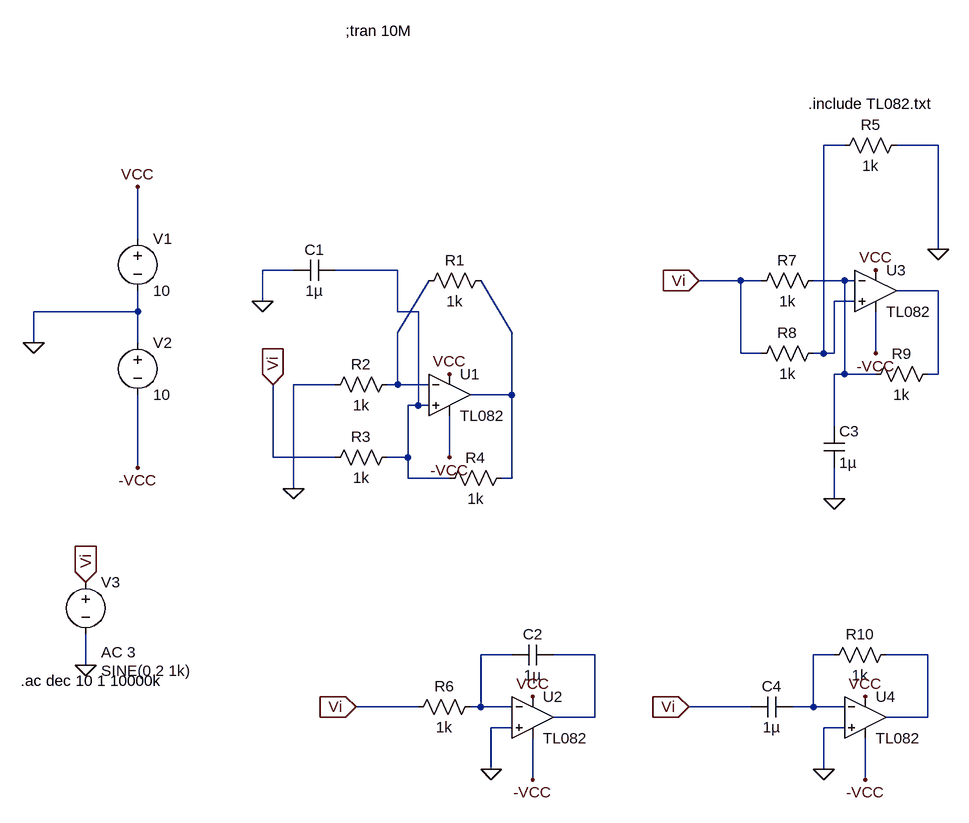
[diagram p0: schematic Calk2.asc]
Calk2.asc, the LTspice schematic file:
Version 4
SHEET 1 1360 976
WIRE 864 -224 832 -224
WIRE 1008 -224 944 -224
WIRE -224 -80 -224 -160
WIRE 1008 -64 1008 -224
WIRE 16 -32 -32 -32
WIRE 176 -32 80 -32
WIRE 704 -16 640 -16
WIRE 736 -16 704 -16
WIRE 864 -16 816 -16
WIRE 880 -16 864 -16
WIRE 1008 0 944 0
WIRE -32 16 -32 -32
WIRE 880 16 848 16
WIRE -224 32 -224 0
WIRE -224 32 -384 32
WIRE 176 32 176 -32
WIRE 208 32 176 32
WIRE 176 64 224 -16
WIRE 352 64 304 -16
WIRE -384 80 -384 32
WIRE -224 80 -224 32
WIRE 704 96 704 -16
WIRE 736 96 704 96
WIRE 832 96 832 -224
WIRE 832 96 816 96
WIRE 848 96 848 16
WIRE 848 96 832 96
WIRE 912 96 912 32
WIRE 864 128 864 -16
WIRE 864 128 848 128
WIRE 912 128 864 128
WIRE 1008 128 1008 0
WIRE 1008 128 992 128
WIRE 80 144 16 144
WIRE 176 144 176 64
WIRE 176 144 160 144
WIRE 224 144 176 144
WIRE 352 160 352 64
WIRE 352 160 288 160
WIRE 208 176 208 32
WIRE 208 176 192 176
WIRE 224 176 208 176
WIRE 848 208 848 128
WIRE -16 256 -16 144
WIRE 80 256 -16 256
WIRE 192 256 192 176
WIRE 192 256 160 256
WIRE 256 256 256 192
WIRE -224 272 -224 160
WIRE 192 288 192 256
WIRE 256 288 192 288
WIRE 352 288 352 160
WIRE 352 288 336 288
WIRE 16 304 16 144
WIRE 848 320 848 272
WIRE 352 560 304 560
WIRE 480 560 416 560
WIRE 848 560 816 560
WIRE 992 560 928 560
WIRE -304 576 -304 528
WIRE 208 640 112 640
WIRE 304 640 304 560
WIRE 304 640 288 640
WIRE 352 640 304 640
WIRE 720 640 624 640
WIRE 816 640 816 560
WIRE 816 640 784 640
WIRE 864 640 816 640
WIRE 480 656 480 560
WIRE 480 656 416 656
WIRE 992 656 992 560
WIRE 992 656 928 656
WIRE 352 672 320 672
WIRE 864 672 832 672
WIRE 320 736 320 672
WIRE 832 736 832 672
WIRE 384 752 384 688
WIRE 896 752 896 688
FLAG -224 -160 VCC
FLAG -224 272 -VCC
FLAG -384 80 0
FLAG -304 448 Vi
IOPIN -304 448 In
FLAG -16 144 Vi
IOPIN -16 144 In
FLAG -304 576 0
FLAG 16 304 0
FLAG -32 16 0
FLAG 256 128 VCC
FLAG 256 256 -VCC
FLAG 112 640 Vi
IOPIN 112 640 In
FLAG 384 624 VCC
FLAG 384 752 -VCC
FLAG 320 736 0
FLAG 640 -16 Vi
IOPIN 640 -16 In
FLAG 912 -32 VCC
FLAG 912 96 -VCC
FLAG 848 320 0
FLAG 1008 -64 0
FLAG 624 640 Vi
IOPIN 624 640 In
FLAG 896 624 VCC
FLAG 896 752 -VCC
FLAG 832 736 0
SYMBOL voltage -224 -96 R0
WINDOW 123 0 0 Left 2
WINDOW 39 0 0 Left 2
SYMATTR InstName V1
SYMATTR Value 10
SYMBOL Opamps\\opamp2 256 96 R0
SYMATTR InstName U1
SYMATTR Value TL082
SYMBOL res 208 0 R270
WINDOW 0 32 56 VTop 2
WINDOW 3 0 56 VBottom 2
SYMATTR InstName R1
SYMATTR Value 1k
SYMBOL res 64 160 R270
WINDOW 0 32 56 VTop 2
WINDOW 3 0 56 VBottom 2
SYMATTR InstName R2
SYMATTR Value 1k
SYMBOL res 64 272 R270
WINDOW 0 32 56 VTop 2
WINDOW 3 0 56 VBottom 2
SYMATTR InstName R3
SYMATTR Value 1k
SYMBOL res 240 304 R270
WINDOW 0 32 56 VTop 2
WINDOW 3 0 56 VBottom 2
SYMATTR InstName R4
SYMATTR Value 1k
SYMBOL voltage -224 64 R0
WINDOW 123 0 0 Left 2
WINDOW 39 0 0 Left 2
SYMATTR InstName V2
SYMATTR Value 10
SYMBOL voltage -304 432 R0
WINDOW 3 24 152 Left 2
WINDOW 123 24 124 Left 2
WINDOW 39 0 0 Left 2
SYMATTR InstName V3
SYMATTR Value SINE(0 2 1k)
SYMATTR Value2 AC 3
SYMBOL cap 16 -16 R270
WINDOW 0 32 32 VTop 2
WINDOW 3 0 32 VBottom 2
SYMATTR InstName C1
SYMATTR Value 1µ
SYMBOL Opamps\\opamp2 384 592 R0
SYMATTR InstName U2
SYMATTR Value TL082
SYMBOL res 192 656 R270
WINDOW 0 32 56 VTop 2
WINDOW 3 0 56 VBottom 2
SYMATTR InstName R6
SYMATTR Value 1k
SYMBOL cap 352 576 R270
WINDOW 0 32 32 VTop 2
WINDOW 3 0 32 VBottom 2
SYMATTR InstName C2
SYMATTR Value 1µ
SYMBOL Opamps\\opamp2 912 -64 R0
SYMATTR InstName U3
SYMATTR Value TL082
SYMBOL res 848 -208 R270
WINDOW 0 32 56 VTop 2
WINDOW 3 0 56 VBottom 2
SYMATTR InstName R5
SYMATTR Value 1k
SYMBOL res 720 0 R270
WINDOW 0 32 56 VTop 2
WINDOW 3 0 56 VBottom 2
SYMATTR InstName R7
SYMATTR Value 1k
SYMBOL res 720 112 R270
WINDOW 0 32 56 VTop 2
WINDOW 3 0 56 VBottom 2
SYMATTR InstName R8
SYMATTR Value 1k
SYMBOL res 896 144 R270
WINDOW 0 32 56 VTop 2
WINDOW 3 0 56 VBottom 2
SYMATTR InstName R9
SYMATTR Value 1k
SYMBOL cap 832 208 R0
SYMATTR InstName C3
SYMATTR Value 1µ
SYMBOL Opamps\\opamp2 896 592 R0
SYMATTR InstName U4
SYMATTR Value TL082
SYMBOL res 832 576 R270
WINDOW 0 32 56 VTop 2
WINDOW 3 0 56 VBottom 2
SYMATTR InstName R10
SYMATTR Value 1k
SYMBOL cap 720 656 R270
WINDOW 0 32 32 VTop 2
WINDOW 3 0 32 VBottom 2
SYMATTR InstName C4
SYMATTR Value 1µ
TEXT -404 600 Left 2 !.ac dec 10 1 10000k
TEXT 808 -288 Left 2 !.include TL082.txt
TEXT 96 -400 Left 2 !;tran 10M

The netlist it stands for:
* Calk2.asc
V1 VCC 0 10
XU1 N002 N005 VCC -VCC N006 TL082  ; pins In+ In- V+ V- OUT
R1 N005 N006 1k
R2 0 N005 1k
R3 Vi N002 1k
R4 N002 N006 1k
V2 0 -VCC 10
V3 Vi 0 SINE(0 2 1k) AC 3
C1 0 N002 1µ
XU2 0 N007 VCC -VCC N008 TL082  ; pins In+ In- V+ V- OUT
R6 Vi N007 1k
C2 N007 N008 1µ
XU3 N001 N003 VCC -VCC N004 TL082  ; pins In+ In- V+ V- OUT
R5 N001 0 1k
R7 Vi N003 1k
R8 Vi N001 1k
R9 N003 N004 1k
C3 N003 0 1µ
XU4 0 N009 VCC -VCC N010 TL082  ; pins In+ In- V+ V- OUT
R10 N009 N010 1k
C4 Vi N009 1µ
.ac dec 10 1 10000k
.include TL082.txt
;tran 10M
.backanno
.end